# Altium schematic sheet ART-Pi_F103_AP6212.SchDoc: ST-LINK_V2.1&AP6212A
size A3; DocumentNumber: 11; Revision: V1.5; SheetNumber: 11; SheetTotal: 11; PageSetup: Record=PageOptions|CenterHorizontal=True|CenterVertical=True|PrintScale=1.01|XCorrection=1.00|YCorrection=1.00|PrintKind=0|BorderSize=5000000|LeftOffset=0|BottomOffset=0|Orientation=2|PaperLength=1000|PaperWidth=1000|Scale=100|PaperSource=7|PrintQuality=600|MediaType=1|DitherType=10|PrintScaleMode=1|PaperKind=A3(297x420mm)|PaperIndex=8
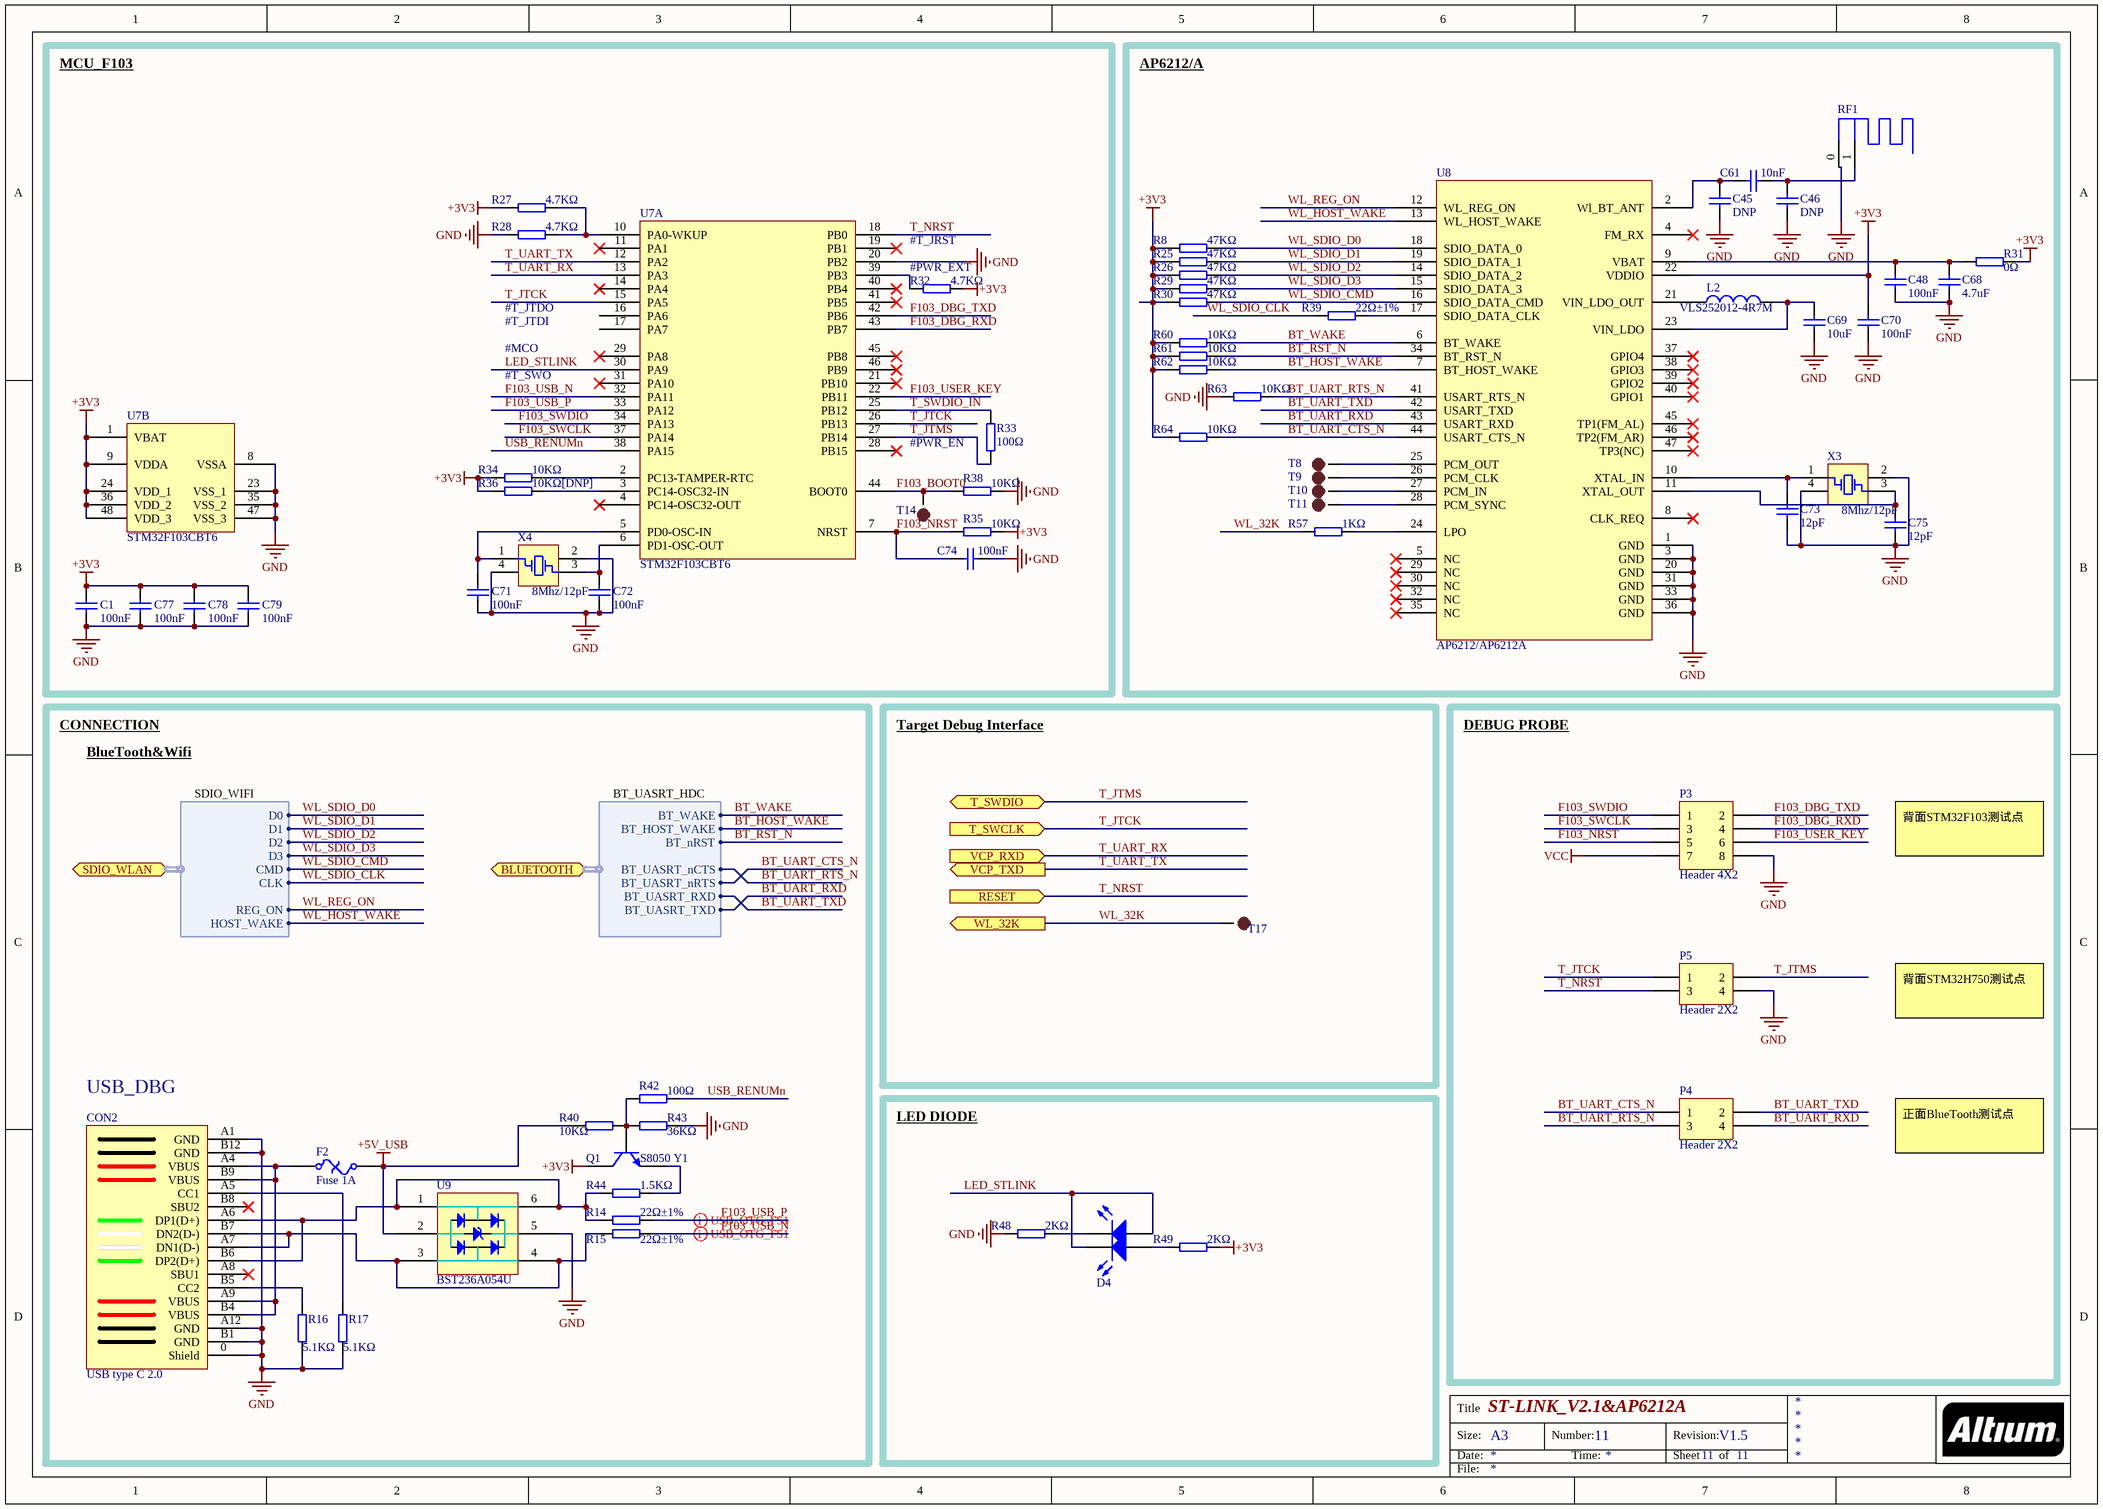
[diagram p0: ART-Pi_F103_AP6212.SchDoc]

## Parts
C1  100nF  [0402_C]
C45  DNP  [0402_C]
C46  DNP  [0402_C]
C48  100nF  [0402_C]
C61  10nF  [0402_C]
C68  4.7uF  [0402_C]
C69  10uF  [0402_C]
C70  100nF  [0402_C]
C71  100nF  [0402_C]
C72  100nF  [0402_C]
C73  12pF  [0402_C]
C74  100nF  [0402_C]
C75  12pF  [0402_C]
C77  100nF  [0402_C]
C78  100nF  [0402_C]
C79  100nF  [0402_C]
CON2  USB type C 2.0  [USB_C]
D4  LED2  [LED2-0603]  (value not drawn)
F2  Fuse 1A  [0805_R]
L2  VLS252012-4R7M  [FNR252012S]
P3  Header 4X2  [Test_Point_8]
P4  Header 2X2  [Test_Point_4]
P5  Header 2X2  [Test_Point_4]
Q1  S8050 Y1  [SOT23_P]
R8  47KΩ  [0402_R]
R14  22Ω±1%  [0402_R]
R15  22Ω±1%  [0402_R]
R16  5.1KΩ  [0402_R]
R17  5.1KΩ  [0402_R]
R25  47KΩ  [0402_R]
R26  47KΩ  [0402_R]
R27  4.7KΩ  [0402_R]
R28  4.7KΩ  [0402_R]
R29  47KΩ  [0402_R]
R30  47KΩ  [0402_R]
R31  0Ω  [0402_R]
R32  4.7KΩ  [0402_R]
R33  100Ω  [0402_R]
R34  10KΩ  [0402_R]
R35  10KΩ  [0402_R]
R36  10KΩ[DNP]  [0402_R]
R38  10KΩ  [0402_R]
R39  22Ω±1%  [0402_R]
R40  10KΩ  [0402_R]
R42  100Ω  [0402_R]
R43  36KΩ  [0402_R]
R44  1.5KΩ  [0402_R]
R48  2KΩ  [0402_R]
R49  2KΩ  [0402_R]
R57  1KΩ  [0402_R]
R60  10KΩ  [0402_R]
R61  10KΩ  [0402_R]
R62  10KΩ  [0402_R]
R63  10KΩ  [0402_R]
R64  10KΩ  [0402_R]
RF1  ANT  [RF]  (value not drawn)
T8  TEST POINT  [Test_Point]  (value not drawn)
T9  TEST POINT  [Test_Point]  (value not drawn)
T10  TEST POINT  [Test_Point]  (value not drawn)
T11  TEST POINT  [Test_Point]  (value not drawn)
T14  TEST POINT  [Test_Point]  (value not drawn)
T17  TEST POINT  [Test_Point]  (value not drawn)
U7  STM32F103CBT6  [LQFP48_N]  (parts A,B of 2)
U8  AP6212/AP6212A  [AP6212A]
U9  BST236A054U  [SOT23_6]
X3  8Mhz/12pF  [SMD2520]
X4  8Mhz/12pF  [XT-3225-4P]

## Blocks framed on the sheet
MCU_F103: C1 C71 C72 C74 C77-C79 R27 R28 R32-R36 R38 T14 U7 X4
AP6212/A: C45 C46 C48 C61 C68-C70 C73 C75 L2 R8 R25 R26 R29-R31 R39 R57 R60-R64 RF1 T8-T11 U8 X3
USB_DBG: CON2 F2 Q1 R14-R17 R40 R42-R44 U9
Target Debug Interface: T17
DEBUG PROBE: P3-P5
LED DIODE: D4 R48 R49

## Ports
BLUETOOTH (harness Harness), RESET (in), SDIO_WLAN (harness Harness), T_SWCLK (in), T_SWDIO (bidir), VCP_RXD (in), VCP_TXD (out), WL_32K (out)

## Harnesses
Harness: D0, D1, D2, D3, CMD, CLK, REG_ON, HOST_WAKE
Harness: BT_WAKE, BT_HOST_WAKE, BT_nRST, BT_UASRT_nCTS, BT_UASRT_nRTS, BT_UASRT_RXD, BT_UASRT_TXD

## Nets
+3V3: C1.2 C70.1 C77.2 C78.2 C79.2 Q1.1(C) R8.1 R25.1 R26.1 R27.2 R29.1 R30.1 R31.2 R32.1 R34.2 R35.2 R36.2 R49.2 R60.1 R61.1 R62.1 R64.1 U7.1(VBAT) U7.9(VDDA) U7.24(VDD_1) U7.36(VDD_2) U7.48(VDD_3) U8.22(VDDIO)
+5V_USB: F2.2 R40.1 U9.2
GND: C1.1 C45.2 C46.2 C48.2 C68.2 C69.2 C70.2 C71.1 C72.1 C73.2 C74.1 C75.2 C77.1 C78.1 C79.1 CON2.0(Shield) CON2.A1(GND) CON2.A12(GND) CON2.B1(GND) CON2.B12(GND) P3.8 P5.4 R16.2 R17.2 R28.2 R38.2 R43.2 R48.1 R63.1 RF1.0 U7.8(VSSA) U7.20(PB2) U7.23(VSS_1) U7.35(VSS_2) U7.47(VSS_3) U8.1(GND) U8.3(GND) U8.20(GND) U8.31(GND) U8.33(GND) U8.36(GND) U9.5 X3.2(OSC2) X3.4 X4.2(OSC2) X4.4
VCC: P3.7
BT_HOST_WAKE: R62.2 U8.7(BT_HOST_WAKE) ; port BLUETOOTH.BT_HOST_WAKE
BT_RST_N: R61.2 U8.34(BT_RST_N) ; port BLUETOOTH.BT_nRST
BT_UART_CTS_N: P4.1 R64.2 U8.44(USART_CTS_N) ; port BLUETOOTH.BT_UASRT_nRTS
BT_UART_RTS_N: P4.3 R63.2 U8.41(USART_RTS_N) ; port BLUETOOTH.BT_UASRT_nCTS
BT_UART_RXD: P4.4 U8.43(USART_RXD) ; port BLUETOOTH.BT_UASRT_TXD
BT_UART_TXD: P4.2 U8.42(USART_TXD) ; port BLUETOOTH.BT_UASRT_RXD
BT_WAKE: R60.2 U8.6(BT_WAKE) ; port BLUETOOTH.BT_WAKE
F103_BOOT0: R38.1 T14.1 U7.44(BOOT0)
F103_DBG_RXD: P3.4 U7.43(PB7)
F103_DBG_TXD: P3.2 U7.42(PB6)
F103_NRST: C74.2 P3.5 R35.1 U7.7(NRST)
F103_SWCLK: P3.3 U7.37(PA14)
F103_SWDIO: P3.1 U7.34(PA13)
F103_USB_N: R15.2 U7.32(PA11)
F103_USB_P: R14.2 U7.33(PA12)
F103_USER_KEY: P3.6 U7.22(PB11)
LED_STLINK: D4.2 D4.4 U7.30(PA9)
T_JTCK: P5.1 U7.15(PA5) U7.26(PB13) ; port T_SWCLK
T_JTMS: P5.2 R33.2 U7.27(PB14) ; port T_SWDIO
T_NRST: P5.3 U7.18(PB0) ; port RESET
T_SWDIO_IN: R33.1 U7.25(PB12)
T_UART_RX: U7.13(PA3) ; port VCP_RXD
T_UART_TX: U7.12(PA2) ; port VCP_TXD
USB_RENUMn: R42.2 U7.38(PA15)
WL_32K: R57.1 T17.1 ; port WL_32K
WL_HOST_WAKE: U8.13(WL_HOST_WAKE) ; port SDIO_WLAN.HOST_WAKE
WL_REG_ON: U8.12(WL_REG_ON) ; port SDIO_WLAN.REG_ON
WL_SDIO_CLK: R39.1 ; port SDIO_WLAN.CLK
WL_SDIO_CMD: R30.2 U8.16(SDIO_DATA_CMD) ; port SDIO_WLAN.CMD
WL_SDIO_D0: R8.2 U8.18(SDIO_DATA_0) ; port SDIO_WLAN.D0
WL_SDIO_D1: R25.2 U8.19(SDIO_DATA_1) ; port SDIO_WLAN.D1
WL_SDIO_D2: R26.2 U8.14(SDIO_DATA_2) ; port SDIO_WLAN.D2
WL_SDIO_D3: R29.2 U8.15(SDIO_DATA_3) ; port SDIO_WLAN.D3
NetC45_1: C45.1 C61.2 U8.2(Wl_BT_ANT)
NetC46_1: C46.1 C61.1 RF1.1
NetC48_1: C48.1 C68.1 R31.1 U8.9(VBAT)
NetC69_1: C69.1 L2.2 U8.23(VIN_LDO)
NetC71_2: C71.2 U7.5(PD0-OSC-IN) X4.1(OSC1)
NetC72_2: C72.2 U7.6(PD1-OSC-OUT) X4.3
NetC73_1: C73.1 U8.10(XTAL_IN) X3.1(OSC1)
NetC75_1: C75.1 U8.11(XTAL_OUT) X3.3
NetCON2_A4: CON2.A4(VBUS) CON2.A9(VBUS) CON2.B4(VBUS) CON2.B9(VBUS) F2.1
NetCON2_A5: CON2.A5(CC1) R17.1
NetCON2_A6: CON2.A6(DP1(D+)) CON2.B6(DP2(D+)) R14.1 R44.1 U9.1 U9.6
NetCON2_A7: CON2.A7(DN1(D-)) CON2.B7(DN2(D-)) R15.1 U9.3 U9.4
NetCON2_B5: CON2.B5(CC2) R16.1
NetD4_1: D4.1 R49.1
NetD4_3: D4.3 R48.2
NetL2_1: L2.1 U8.21(VIN_LDO_OUT)
NetQ1_2: Q1.2(E) R44.2
NetQ1_3: Q1.3(B) R40.2 R42.1 R43.1
NetR27_1: R27.1 R28.1 U7.10(PA0-WKUP)
NetR32_2: R32.2 U7.39(PB3)
NetR34_1: R34.1 U7.2(PC13-TAMPER-RTC)
NetR36_1: R36.1 U7.3(PC14-OSC32-IN)
NetR39_2: R39.2 U8.17(SDIO_DATA_CLK)
NetR57_2: R57.2 U8.24(LPO)
NetT8_1: T8.1 U8.25(PCM_OUT)
NetT9_1: T9.1 U8.26(PCM_CLK)
NetT10_1: T10.1 U8.27(PCM_IN)
NetT11_1: T11.1 U8.28(PCM_SYNC)

Not connected (* = marked no-connect by the designer): CON2 A8(SBU1)* B8(SBU2)*; U7 4(PC14-OSC32-OUT)* 11(PA1)* 14(PA4)* 16(PA6) 17(PA7) 19(PB1)* 21(PB10)* 28(PB15)* 29(PA8)* 31(PA10)* 40(PB4)* 41(PB5)* 45(PB8)* 46(PB9)*; U8 4(FM_RX)* 5(NC)* 8(CLK_REQ)* 29(NC)* 30(NC)* 32(NC)* 35(NC)* 37(GPIO4)* 38(GPIO3)* 39(GPIO2)* 40(GPIO1)* 45(TP1(FM_AL))* 46(TP2(FM_AR))* 47(TP3(NC))*

## Layout directives
differential pair: F103_USB_N, F103_USB_P

## Notes on the sheet
- #T_JRST
- #T_JTDO
- (near R32) #PWR_EXT
- #T_JTDI
- #MCO
- #T_SWO
- #PWR_EN
- CONNECTION
- BlueTooth&Wifi
- SDIO_WIFI
- BT_UASRT_HDC
- 背面STM32F103测试点
- 背面STM32H750测试点
- 正面BlueTooth测试点
- Title
- Size:
- Date:
- A3
- Number:
- Time:
- Revision:
- Sheet
- of
- File:

## Library data of the parts
C1 C45 C46 C48 C61 C68-C75 C77-C79 = Cap: Capacitor; Published: 8-Jun-2000; LatestRevisionDate: 17-Jul-2002; LatestRevisionNote: Re-released for DXP Platform.; PackageReference: RAD-0.3; Publisher: Altium Limited; PackageDescription: Radial Cap, Thru-Hole; 2 Leads; 0.3 in Pin Spacing
CON2 = USB type C
D4 = LED2: Typical RED, GREEN, YELLOW, AMBER GaAs LED; Published: 8-Jun-2000; LatestRevisionDate: 17-Jul-2002; LatestRevisionNote: Re-released for DXP Platform.; PackageVersion: Feb-2002; PackageReference: 3.2X1.6X1.1; Publisher: Altium Limited; PackageDescription: SM LED; 2 Flat Leads
F2 = Fuse Thermal: Thermal Fuse; Published: 24-Mar-1999; LatestRevisionDate: 17-Jul-2002; LatestRevisionNote: Re-released for DXP Platform.; PackageReference: PIN-W2/E2.8; Publisher: Altium Limited; PackageDescription: Thru-Hole; 2 Leads
L2 = Inductor: Code_IEC: 1005; Value: 10mH; Published: 8-Jun-2000; LatestRevisionDate: 29-May-2009; LatestRevisionNote: IPC-7351 Footprint Added.; PackageReference: 0402-A; Publisher: Altium Limited; PackageDescription: Chip Inductor; Code_JEITA: 0402
P3 = Header 4X2: Header, 4-Pin, Dual row; LatestRevisionDate: 17-Jul-2002; LatestRevisionNote: Re-released for DXP Platform.; Publisher: Altium Limited
P4 P5 = Header 2X2: Header, 2-Pin, Dual row; LatestRevisionDate: 17-Jul-2002; LatestRevisionNote: Re-released for DXP Platform.; Publisher: Altium Limited
Q1 = NPN: NPN Bipolar Transistor; Published: 8-Jun-2000; LatestRevisionDate: 17-Jul-2002; LatestRevisionNote: Re-released for DXP Platform.; PackageReference: TO-226-AA; Publisher: Altium Limited; PackageDescription: TO, Flat Index; 3 In-Line, Axial Leads; Body Dia. 4.8mm; Leads 0.55 x 0.51 mm (max); Code_JEDEC: TO-226-AA
R8 R14-R17 R25-R36 R38-R40 R42-R44 R48 R49 R57 R60-R64 = Res: Resister
RF1 = PCB-ANT-2.4G-S
T8-T11 T14 T17 = TEST-POINT: 测试点
X3 X4 = XTAL_3225: Crystal Oscillator; Published: 8-Jun-2000; LatestRevisionDate: 17-Jul-2002; LatestRevisionNote: Re-released for DXP Platform.; PackageReference: R38; Publisher: Altium Limited; PackageDescription: Crystal, Thru-Hole; 2 Leads; Body 3.1 x 8.2 mm (Dia.xH)